# EAGLE schematic bare_ESP-mainboard (EAGLE 9.6.2)
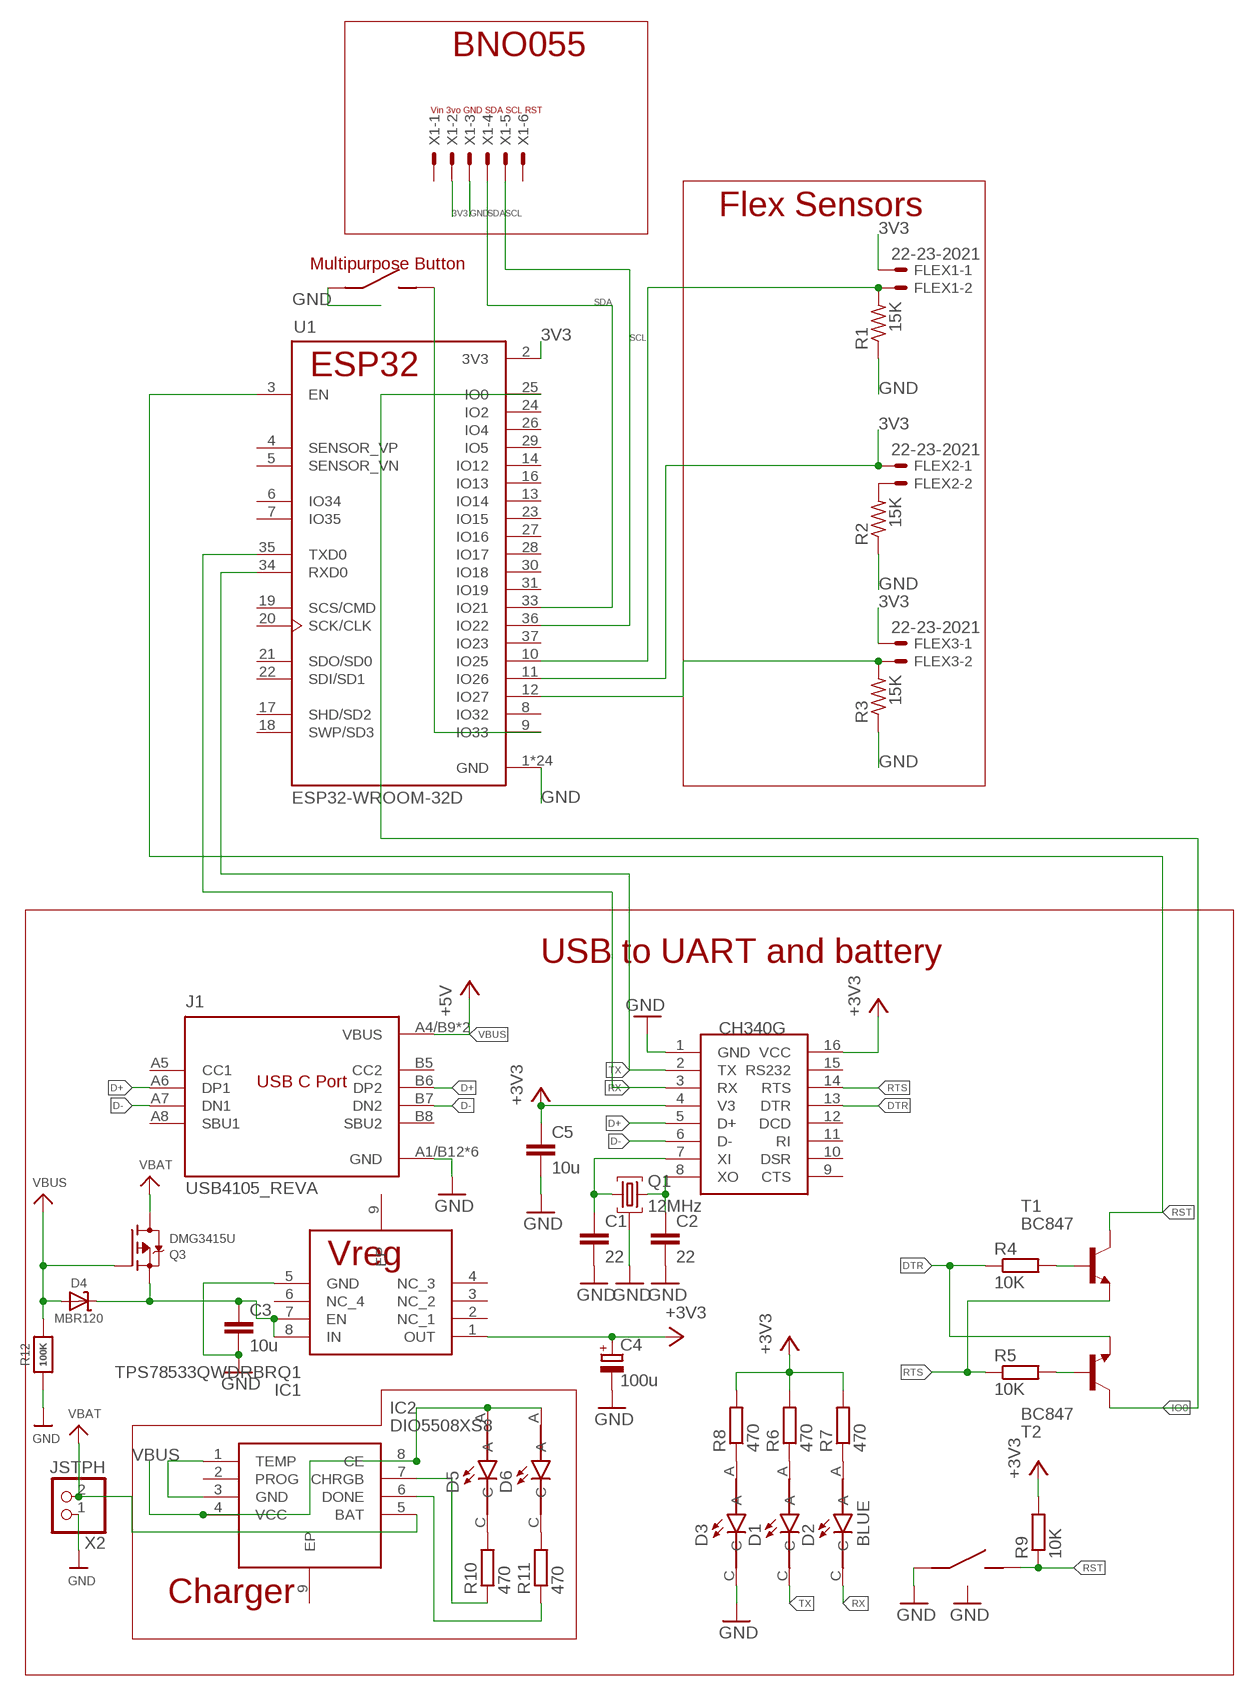
[diagram p0: schematic, sheet 1]

## Parts
BTN1  TS36CA-0.7  [SMD]
BTN2  TS36CA-0.7  [SMD]
C1  22  C-EUC0603  [C0603]
C2  22  C-EUC0603  [C0603]
C3  10u  C-EUC0603  [C0603]
C4  100u  CPOL-EUB/3528-21W  [B/3528-21W]
C5  10u  C-EUC0603  [C0603]
D1  BLUE  597-5311-402F  [LEDC2012X70N]
D2  BLUE  597-5311-402F  [LEDC2012X70N]
D3  GREEN  597-5311-402F  [LEDC2012X70N]
D4  MBR120  DIODE-SCHOTTKYSOD-123  [SOD-123]
D5  GREEN  597-5311-402F  [LEDC2012X70N]
D6  GREEN  597-5311-402F  [LEDC2012X70N]
FLEX1  22-23-2021  [22-23-2021]
FLEX2  22-23-2021  [22-23-2021]
FLEX3  22-23-2021  [22-23-2021]
IC1  TPS78533QWDRBRQ1  [SON65P300X300X100-9N]
IC2  DIO5508XS8  [SOIC127P600X170-9N]
J1  USB4105_REVA  [GCT_USB4105_REVA]
Q1  12MHz  YSX321SL  [SMD3225]
Q3  DMG3415U  MOSFET-P  [SOT23-R]
R1  15K  FLIPFLOP-RES  [0805-THM]
R2  15K  FLIPFLOP-RES  [0805-THM]
R3  15K  FLIPFLOP-RES  [0805-THM]
R4  10K  R-EU_R0603  [R0603]
R5  10K  R-EU_R0603  [R0603]
R6  470  R-EU_R0603  [R0603]
R7  470  R-EU_R0603  [R0603]
R8  470  R-EU_R0603  [R0603]
R9  10K  R-EU_R0603  [R0603]
R10  470  R-EU_R0603  [R0603]
R11  470  R-EU_R0603  [R0603]
R12  100K  RESISTOR_0603_NOOUT  [0603-NO]
T1  BC847  [SOT23]
T2  BC847  [SOT23]
U1  ESP32-WROOM-32D  [MODULE_ESP32-WROOM-32D]
U2  CH340G  [SOIC16]
X1  22-23-2061  [22-23-2061]
X2  JSTPH  CON_JST_PH_2PIN  [JSTPH2]

## Nets
3V3: FLEX1.1 FLEX2.1 FLEX3.1 U1.2(3V3) U1.11(IO26) X1.2
+3V3 [VCC]: C4.+ C5.1 IC1.1(OUT) R6.2 R7.2 R8.2 R9.2 U2.4(V3) U2.16(VCC)
D+: J1.A6(DP1) J1.B6(DP2) U2.5(D+)
D-: J1.A7(DN1) J1.B7(DN2) U2.6(D-)
DTR: R4.1 T2.2(E) U2.13(DTR)
GND: BTN1.A(CASE) BTN1.B(CASE) BTN1.C BTN2.A(CASE) BTN2.B(CASE) BTN2.C C1.2 C2.2 C3.2 C4.- C5.2 D3.C IC1.5(GND) J1.A1/B12(GND) J1.B1/A12(GND) J1.G1(GND) J1.G2(GND) J1.G3(GND) J1.G4(GND) Q1.P$2(CASE) Q1.P$4(CASE) R1.1 R2.1 R3.1 R12.1 U1.1(GND) U1.15(GND) U1.38(GND) U1.39_1(GND) U1.39_2(GND) U1.39_3(GND) U1.39_4(GND) U1.39_5(GND) U1.39_6(GND) U1.39_7(GND) U1.39_8(GND) U1.39_9(GND) U1.39_10(GND) U1.39_11(GND) U1.39_12(GND) U1.39_13(GND) U1.39_14(GND) U1.39_15(GND) U1.39_16(GND) U1.39_17(GND) U1.39_18(GND) U1.39_19(GND) U1.39_20(GND) U1.39_21(GND) U2.1(GND) X1.3 X2.1
IO0: T2.3(C) U1.25(IO0)
N$1: C2.1 Q1.P$3 U2.8(XO)
N$2: C1.1 Q1.P$1 U2.7(XI)
N$3: R4.2 T1.1(B)
N$4: R5.2 T2.1(B)
N$5: D1.A R6.1
N$6: FLEX1.2 R1.2 U1.10(IO25)
N$7: FLEX2.2 R2.2
N$8: FLEX3.2 R3.2 U1.12(IO27)
N$9: D3.A R8.1
N$11: BTN2.D U1.9(IO33)
N$12: D2.A R7.1
N$13: IC2.1(TEMP) IC2.3(GND)
N$14: D5.C R10.2
N$15: D6.C R11.2
N$16: IC2.7(CHRGB) R10.1
N$17: IC2.6(DONE) R11.1
N$18: C3.1 D4.C IC1.7(EN) IC1.8(IN) Q3.2(S)
RST: BTN1.D R9.1 T1.3(C) U1.3(EN)
RTS: R5.1 T1.2(E) U2.14(RTS)
RX: D2.C U1.35(TXD0) U2.3(RX)
SCL: U1.36(IO22) X1.5
SDA: U1.33(IO21) X1.4
TX: D1.C U1.34(RXD0) U2.2(TX)
VBAT: IC2.5(BAT) Q3.3(D) X2.2
VBUS [VCC]: D4.A D5.A D6.A IC2.4(VCC) IC2.8(CE) J1.A4/B9(VBUS) J1.B4/A9(VBUS) Q3.1(G) R12.2 ; supply symbol labelled +5V
Unconnected: IC1.2(NC_1) IC1.3(NC_2) IC1.4(NC_3) IC1.6(NC_4) IC1.9(EP) IC2.2(PROG) IC2.9(EP) J1.A5(CC1) J1.A8(SBU1) J1.B5(CC2) J1.B8(SBU2) U1.4(SENSOR_VP) U1.5(SENSOR_VN) U1.6(IO34) U1.7(IO35) U1.8(IO32) U1.13(IO14) U1.14(IO12) U1.16(IO13) U1.17(SHD/SD2) U1.18(SWP/SD3) U1.19(SCS/CMD) U1.20(SCK/CLK) U1.21(SDO/SD0) U1.22(SDI/SD1) U1.23(IO15) U1.24(IO2) U1.26(IO4) U1.27(IO16) U1.28(IO17) U1.29(IO5) U1.30(IO18) U1.31(IO19) U1.37(IO23) U2.9(CTS) U2.10(DSR) U2.11(RI) U2.12(DCD) U2.15(RS232) X1.1 X1.6

## Notes on the sheet
- BNO055
- Vin 3vo GND SDA SCL RST
- Flex Sensors
- Multipurpose Button
- ESP32
- USB to UART and battery
- USB C Port
- Vreg
- Charger

## Library data of the parts
BTN1 BTN2 = SMD Tact:TS36CA-0.7: SHOU HAN TS36CA-0.7; LCSC#: C412365; MF: SHOU HAN; MP: TS36CA-0.7
C1-C3 C5 = rcl:C-EU: CAPACITOR, European symbol; SPICEPREFIX: C
C4 = rcl:CPOL-EU: POLARIZED CAPACITOR, European symbol; SPICEPREFIX: C
D1-D3 D5 D6 = 597-5311-402F:597-5311-402F: LED Uni-Color Green 560nm 2-Pin Chip 0805(2012Metric) Strip; AVAILABILITY: Unavailable; DESCRIPTION: LED Uni-Color Green 560nm 2-Pin Chip 0805_2012Metric_ Tape; MF: Dialight; MP: 597-5311-402F; PACKAGE: 0805 Dialight; PRICE: None
D4 = microbuilder:DIODE-SCHOTTKY
FLEX1-FLEX3 = con-molex:22-23-2021: .100" (2.54mm) Center Header - 2 Pin; MF: MOLEX; MPN: 22-23-2021; OC_FARNELL: 1462926; OC_NEWARK: 25C3832
IC1 = TPS78533QWDRBRQ1:TPS78533QWDRBRQ1: LDO Voltage Regulators Automotive, 1-A, high-accuracy, adjustable low-dropout (LDO) linear regulator Source: Datasheet <https://www.arrow.com/en/products/tps78533qwdrbrq1/texas-instruments?region=nac>; DESCRIPTION: LDO Voltage Regulators Automotive, 1-A, high-accuracy, adjustable low-dropout (LDO) linear regulator; HEIGHT: 1mm; MANUFACTURER_NAME: Texas Instruments; MANUFACTURER_PART_NUMBER: TPS78533QWDRBRQ1; MOUSER_PART_NUMBER: 595-TPS78533QWDRBRQ1; MOUSER_PRICE-STOCK: https://www.mouser.co.uk/ProductDetail/Texas-Instruments/TPS78533QWDRBRQ1?qs=iLbezkQI%252BsiNbdqh2Ko9GQ%3D%3D
IC2 = DIO5508XS8:DIO5508XS8: Battery Management 1A Lithium Ion Battery Charger IC Source: Datasheet <https://www.mouser.co.uk/datasheet/2/802/dimi_s_a0009242516_1-2295248.pdf>; DESCRIPTION: Battery Management 1A Lithium Ion Battery Charger IC; HEIGHT: 1.7mm; MANUFACTURER_NAME: DIOO Microcircuits; MANUFACTURER_PART_NUMBER: DIO5508XS8; MOUSER_PART_NUMBER: 453-DIO5508XS8; MOUSER_PRICE-STOCK: https://www.mouser.co.uk/ProductDetail/DIOO-Microcircuits/DIO5508XS8?qs=wUXugUrL1qzPv8nEmpxvyA%3D%3D
J1 = USB4105_REVA:USB4105_REVA: USB Type C Receptacle for USB 2.0 SMT Type, PCB Top Mount; AVAILABILITY: Unavailable; DESCRIPTION: USB-C (USB TYPE-C) USB 2.0 Receptacle Connector 24 (16+8 Dummy) Position Surface Mount, Right Angle; Through Hole; MF: Global Connector Technology; MP: USB4105; PACKAGE: Package; PRICE: None
Q1 = crystal:YSX321SL: SMD Crystal Resonator Yangxing Tech X322512MSB4SI Passive SMD Crystal; MF: Yangxing Tech; MP: X322512MSB4SI; PACKAGE: SMD3225
Q3 = microbuilder:MOSFET-P: P-Channel Mosfet LEGEND VDS: Voltage Drain-Source ID: Drain Current RDS(ON): Drain-Source On-State Resistance VGS(TH): Gate-Source Threshold Voltage CISS: Drain-Source Input Capacitance SOT-23 Name VDS ID RDS(ON) VGS(TH) CISS Order Number IRLML5103 30V 760mA 600 mOhm -- 75pF @ 25V Digikey: IRLML5103PBFCT-ND IRLML6401 12V 4.3A 50 mOhm 950mV @ 250µA 830pF @ 10V Digikey: IRLML6401PBFTR-ND NTR0202PL 20V 400mA 800 mOhm 2.3V @ 250uA 70pF @ 5V Digikey: NTR0202PLT1GOSTR-ND NTR4101PT1G 20V 1.8A 85 mOhm 1.2V @ 250uA 675pF @ 10V Digikey: NTR4101PT1GOSCT-ND DMP2004K 20V 600mA 900 mOhm 1V @ 250uA 175pF @ 16V Digikey: DMP2004KDICT-ND PMV65XP 20V 3.9A 76 mOhm 950mV @ 1mA 725pF @ 20V Digikey: 568-2358-2-ND TO-252 Name VDS ID RDS(ON) VGS(TH) CISS Order Number AOD417 30V 25A 34 mOhm 3V @ 250µA 920pF @ 15V Digikey: 785-1106-2-ND PowerPak Name VDS ID RDS(ON) VGS(TH) CISS Order Number AON7401 30V 12A 14 mOhm 3V @ 250µA 2600pF @ 15V Digikey: 785-1302-1-ND
R1-R3 = adafruit:FLIPFLOP-RES: Flip Flop resistor An 0805 resistor inside a standard 1/4W 5% resistor. Makes for easy mods
R4-R11 = rcl:R-EU_: RESISTOR, European symbol; SPICEPREFIX: R
R12 = microbuilder:RESISTOR: Resistors For new designs, use the packages preceded by an '_' character since they are more reliable: The following footprints should be used on most boards: _0402 - Standard footprint for regular board layouts _0603 - Standard footprint for regular board layouts _0805 - Standard footprint for regular board layouts _1206 - Standard footprint for regular board layouts For extremely tight-pitch boards where space is at a premium, the following 'micro-pitch' footprints can be used (smaller pads, no silkscreen outline, etc.): _0402MP - Micro-pitch footprint for very dense/compact boards _0603MP - Micro-pitch footprint for very dense/compact boards _0805MP - Micro-pitch footprint for very dense/compact boards _1206MP - Micro-pitch footprint for very dense/compact boards
T1 T2 = transistor:BC847: NPN TRANSISTOR
U1 = ESP32-WROOM-32D:ESP32-WROOM-32D: Bluetooth, WiFi 802.11b/g/n, Bluetooth v4.2 + EDR, Class 1, 2 and 3 Transceiver Module 2.4GHz ~ 2.5GHz Integrated, Trace Surface Mount Check availability <https://pricing.snapeda.com/parts/ESP32-WROOM-32D/Espressif%20Systems/view-part?ref=eda>; AVAILABILITY: In Stock; DESCRIPTION: Bluetooth, WiFi 802.11b/g/n, Bluetooth v4.2 +EDR, Class 1, 2 and 3 Transceiver Module 2.4GHz ~ 2.5GHz Integrated; MF: Espressif Systems; MP: ESP32-WROOM-32D; PACKAGE: Module Espressif Systems; PRICE: None; PURCHASE-URL: https://pricing.snapeda.com/search/part/ESP32-WROOM-32D/?ref=eda
U2 = ch340g:CH340G
X1 = con-molex:22-23-2061: .100" (2.54mm) Center Header - 6 Pin; MF: MOLEX; MPN: 22-23-2061; OC_FARNELL: 1462922; OC_NEWARK: 27C1933
X2 = microbuilder:CON_JST_PH_2PIN: JST 2-Pin Right-Angle Connector PH-Series - 4UConnector: 17311 SH-Series - 4UConnector: 07278

## Net classes
1 GND: width 0.4 mm
2 VCC: width 0.4 mm